# Altium schematic sheet Schematic.SchDoc
size A
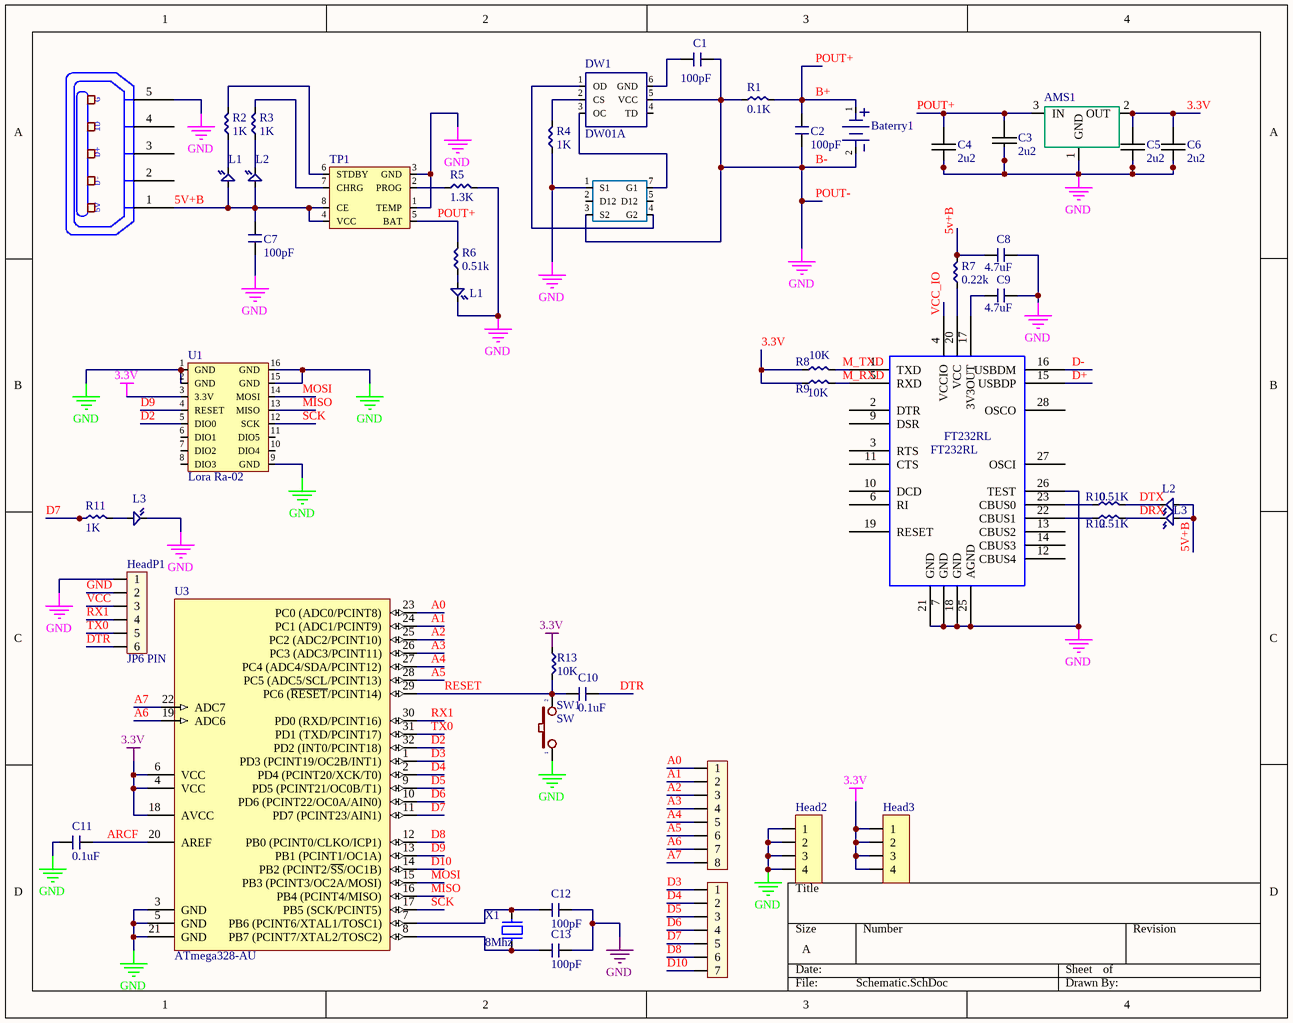
[diagram p0: Schematic.SchDoc]

## Parts
(Parts that share a designator on the sheet are numbered #1, #2 ... from top to bottom, then left to right.)
AMS1  AMS1117 3.3V  [AMS-1117]  (value not drawn)
Baterry1  18650 Baterry  [18650 Baterry]  (value not drawn)
C1  100pF  [C104 0603 SMD]
C2  100pF  [C104 0603 SMD]
C3  2u2  [0603C-2U2]
C4  2u2  [0805C-TBD]
C5  2u2  [0805C-TBD]
C6  2u2  [0603C-2U2]
C7  100pF  [C104 0603 SMD]
C8  4.7uF  [C104 0603 SMD]
C9  4.7uF  [C104 0603 SMD]
C10  0.1uF  [C104 0603 SMD]
C11  0.1uF  [C104 0603 SMD]
C12  100pF  [C104 0603 SMD]
C13  100pF  [C104 0603 SMD]
DW1  DW01A  [SOT23-6L]
FS1  FS8250A  [SOT23-6L]  (value not drawn)
FT232RL  FT232RL  [TSSOP28]
Head1  JP8 PIN  [JP8]  (value not drawn)
Head2  JP4  [JP4-D1T]  (value not drawn)
Head3  JP4  [JP4-D1T]  (value not drawn)
Header1  JP7 PIN  [JP7]  (value not drawn)
HeadP1  JP6 PIN  [JP6]
L1#1  Red  [LED 0603 SMD]  (value not drawn)
L1#2  Red  [LED 0603 SMD]  (value not drawn)
L2#1  Red  [LED 0603 SMD]  (value not drawn)
L2#2  Red  [LED 0603 SMD]  (value not drawn)
L3#1  Red  [LED 0603 SMD]  (value not drawn)
L3#2  Red  [LED 0603 SMD]  (value not drawn)
Micro1  USB-5  [USB-M1]  (value not drawn)
R1  0.1K  [SMD 0603 Res]
R2  1K  [SMD 0603 Res]
R3  1K  [SMD 0603 Res]
R4  1K  [SMD 0603 Res]
R5  1.3K  [SMD 0603 Res]
R6  0.51k  [SMD 0603 Res]
R7  0.22k  [SMD 0603 Res]
R8  10K  [SMD 0603 Res]
R9  10K  [SMD 0603 Res]
R10  0.51K  [SMD 0603 Res]
R11  1K  [SMD 0603 Res]
R12  0.51K  [SMD 0603 Res]
R13  10K  [SMD 0603 Res]
SW1  SW  [SW1-SMD]
TP1  TP4056  [TP4056-SOP8]  (value not drawn)
U1  Lora Ra-02  [Ra-02]
U3  ATmega328-AU  [QFN32]
X1  8Mhz  [XT2-32.768KHz-2_V]

## Nets
3.3V: AMS1.2(OUT) C5.1 C6.1 Head3.1 Head3.2 Head3.3 Head3.4 R8.1 R9.1 R13.1 U1.3(3.3V) U3.4(VCC) U3.6(VCC) U3.18(AVCC)
B-: AMS1.1(GND) Baterry1.2 C1.2 C2.1 C3.2 C4.2 C5.2 C6.2 C7.1 C8.2 C9.2 C11.1 C12.2 C13.2 DW1.5(VCC) FS1.1(S1) FS1.3(S2) FT232RL.7(GND) FT232RL.18(GND) FT232RL.21(GND) FT232RL.25(AGND) FT232RL.26(TEST) Head2.1 Head2.2 Head2.3 Head2.4 HeadP1.1 HeadP1.2 L1#2.2 L3#1.2 Micro1.5(P5) R1.1 R4.1 R5.2 SW1.1 TP1.1(TEMP) TP1.3(GND) U1.1(GND) U1.2(GND) U1.9(GND) U1.15(GND) U1.16(GND) U3.3(GND) U3.5(GND) U3.21(GND)  [also labelled GND, POUT-]
5V+B: C7.2 C8.1 L1#1.1 L2#1.1 L2#2.1 L3#2.1 Micro1.1(P1) R7.2 TP1.4(VCC) TP1.8(CE)
A0: Head1.1 U3.23(PC0_(ADC0/PCINT8))
A1: Head1.2 U3.24(PC1_(ADC1/PCINT9))
A2: Head1.3 U3.25(PC2_(ADC2/PCINT10))
A3: Head1.4 U3.26(PC3_(ADC3/PCINT11))
A4: Head1.5 U3.27(PC4_(ADC4/SDA/PCINT12))
A5: Head1.6 U3.28(PC5_(ADC5/SCL/PCINT13))
A6: Head1.7 U3.19(ADC6)
A7: Head1.8 U3.22(ADC7)
ARCF: C11.2 U3.20(AREF)
B+: AMS1.3(IN) Baterry1.1(B+) C2.2 C3.1 C4.1 R1.2 R6.2 TP1.5(BAT)  [also labelled POUT+]
D2: U1.5(DIO0) U3.32(PD2_(INT0/PCINT18))
D3: Header1.1 U3.1(PD3_(PCINT19/OC2B/INT1))
D4: Header1.2 U3.2(PD4_(PCINT20/XCK/T0))
D5: Header1.3 U3.9(PD5_(PCINT21/OC0B/T1))
D6: Header1.4 U3.10(PD6_(PCINT22/OC0A/AIN0))
D7: Header1.5 R11.1 U3.11(PD7_(PCINT23/AIN1))
D8: Header1.6 U3.12(PB0_(PCINT0/CLKO/ICP1))
D9: U1.4(RESET) U3.13(PB1_(PCINT1/OC1A))
D10: Header1.7 U3.14(PB2_(PCINT2/~{SS}/OC1B))
D+: FT232RL.15(USBDP)
D-: FT232RL.16(USBDM)
DRX: L3#2.2 R12.2
DTR: C10.2 HeadP1.6
DTX: L2#2.2 R10.2
M_RXD: FT232RL.5(RXD) R9.2
M_TXD: FT232RL.1(TXD) R8.2
MISO: U1.13(MISO) U3.16(PB4_(PCINT4/MISO))
MOSI: U1.14(MOSI) U3.15(PB3_(PCINT3/OC2A/MOSI))
RESET: C10.1 R13.2 SW1.2 U3.29(PC6_(~{RESET}/PCINT14))
RX1: HeadP1.4 U3.30(PD0_(RXD/PCINT16))
SCK: U1.12(SCK) U3.17(PB5_(SCK/PCINT5))
TX0: HeadP1.5 U3.31(PD1_(TXD/PCINT17))
VCC: HeadP1.3
VCC_IO: FT232RL.4(VCCIO)
NetC1_1: C1.1 DW1.6(GND)
NetC9_1: C9.1 FT232RL.17(3V3OUT)
NetC12_1: C12.1 U3.7(PB6_(PCINT6/XTAL1/TOSC1)) X1.2
NetC13_1: C13.1 U3.8(PB7_(PCINT7/XTAL2/TOSC2)) X1.1
NetDW1_1: DW1.1(OD) FS1.4(G2)
NetDW1_2: DW1.2(CS) R4.2
NetDW1_3: DW1.3(OC) FS1.7(G1)
NetFT232RL_20: FT232RL.20(VCC) R7.1
NetFT232RL_22: FT232RL.22(CBUS1) R12.1
NetFT232RL_23: FT232RL.23(CBUS0) R10.1
NetL1#1_2: L1#1.2 R2.1
NetL1#2_1: L1#2.1 R6.1
NetL2#1_2: L2#1.2 R3.1
NetL3#1_1: L3#1.1 R11.2
NetR2_2: R2.2 TP1.6(STDBY)
NetR3_2: R3.2 TP1.7(CHRG)
NetR5_1: R5.1 TP1.2(PROG)

Not connected (* = marked no-connect by the designer): DW1 4(TD); FS1 2(D12) 5(D12); FT232RL 2(DTR) 3(RTS) 6(RI) 9(DSR) 10(DCD) 11(CTS) 12(CBUS4) 13(CBUS2) 14(CBUS3) 19(RESET) 27(OSCI) 28(OSCO); Micro1 2(P2) 3(P3) 4(P4); U1 6(DIO1) 7(DIO2) 8(DIO3) 10(DIO4) 11(DIO5)

## Notes on the sheet
- (in symbol USB-5) G; ID; D+; D-; 5V

## Library data of the parts
C1 C2 C7-C13 = C104 SMD: 0603 SMD CAP
C3 C6 = 0603C-2U2-10V-X5R-TDK: CAPACITOR 0603 CERAMIC; Manufacturer: TDK Corporation; Manufacturer Part Number: C1608X5R1A225K; Reel: C11; Supplier 1: Digi-Key; Supplier Part Number 1: 445-5166-2-ND
C4 C5 = 0603C-2U2-6V3-X5R-PAN: CAPACITOR 0805 CERAMIC; Manufacturer Part Number: ECJ-1VB0J225K; Manufacturer: Panasonic - ECG; Supplier 1: Digi-Key; Supplier Part Number 1: PCC2273TR-ND; Reel: *
FT232RL = FT232RL: USB TO UART INTERFACE; Manufacturer: FTDI, Future Technology Devices International Ltd; Manufacturer Part Number: FT232RL R; Number of Channels: 8; Voltage: 3.3 V ~ 5.25 V; FIFO's: 256 Byte; Supplier 1: Digi-Key; Supplier Part Number 1: 768-1007-2-ND; RoHS: RoHS Compliant; Features: Serial Interface; Package / Case: 28-SSOP; Supplier: Digi-Key; Packaging: Tape & Reel (TR); Supplier Part Number: 768-1007-2-ND; Category: Integrated Circuits (ICs)
Head1 = JP8: Value: JP7
Head2 Head3 = JP4: WR-PHD 2.54 mm Angled Socket Header; Manufacturer: W¨¹rth Elektronik eiSos GmbH; partNo: 613004143121; ComponentLink1 Description: Manufacturer; ComponentLink2 Description: Datasheet; NoPins: 04; Created Date: 29 March 2013; ComponentLink1URL: http://www.we-online.com; ComponentLink2URL: http://katalog.we-online.de/em/datasheet/6130xx143121.pdf; Created by: Karrer Zheng
Header1 = JP7_1: Value: JP7
HeadP1 = JP6: Value: JP7
L1#1 L1#2 L2#1 L2#2 L3#1 L3#2 = 0603 SMD LED
Micro1 = USB-5: Manufacturer: FCI; Manufacturer Part Number: 10118193-0001LF; Connector Type: USB - micro B; Number of Contacts: 5; Gender: Receptacle; Specifications: USB 2.0; .Creator: MM; .Checked PCB: RF; Supplier 1: Digi-Key; RoHS: RoHS Compliant; Category: Connectors, Interconnects; Stock 1: 28642; Pricing 1: 1=0.46, 10=0.433, 25=0.3712, 50=0.3156, 100=0.3032, 250=0.27224, 500=0.25988 (USD); Packaging: Cut Tape (CT); Mounting Type: Surface Mount, Right Angle, Horizontal; Features: Shielded, Solder Retention; Ingress Protection: -; ComponentLink1URL: http://portal.fciconnect.com/Comergent//fci/drawing/10118193.pdf; ComponentLink1Description: http://portal.fciconnect.com/Comergent//fci/drawing/10118193.pdf; Supplier Part Number 1: 609-4616-1-ND; .Checked SCH: MM
R1-R13 = 0603 Res
SW1 = SW2: Switch button 2 pin; Value: SW chip 2 pin
U3 = ATmega328-AU: 8-bit AVR Microcontroller, 32KB Flash, 1KB EEPROM, 2KB SRAM, 32-pin TQFP, Industrial Grade (-40°C to 85°C); Published: 1-Apr-2010; DatasheetVersion: revA, Jan-2010; PackageVersion: revB, Oct-2001; PackageReference: 32A; Publisher: Altium Limited; PackageDescription: 32-Lead, 7x7x1.0 mm Body, 0.8mm Lead Pitch, Thin Profile Plastic Quad Flat Package (TQFP); Supplier 1: Digi-Key; Supplier Part Number 1: ATMEGA328-AU-ND; Supplier 2: Mouser; Supplier Part Number 2: 556-ATMEGA328-AU; Code_JEDEC: MS-026-ABA; ComponentLink1Description: Manufacturer Link; ComponentLink1URL: http://www.atmel.com/products/avr/default.asp?; ComponentLink2Description: ATmega48A/48PA/88A/88PA/168A/168PA/328/328P Datasheet; ComponentLink2URL: http://www.atmel.com/dyn/resources/prod_documents/8271.pdf; ComponentLink3Description: ATmega48A/48PA/88A/88PA/168A/168PA/328/328P Summary; ComponentLink3URL: http://www.atmel.com/dyn/resources/prod_documents/8271S.pdf; ComponentLink4Description: Atmel.com Home; ComponentLink4URL: http://www.atmel.com
X1 = XT2: Crystal, 32.768 KHz, -40 to 85 degC, 3.2 x 1.5 x 0.9 mm SMD; Value: 4Mhz